# Altium schematic sheet TPS3702_Breakout.SchDoc
size A
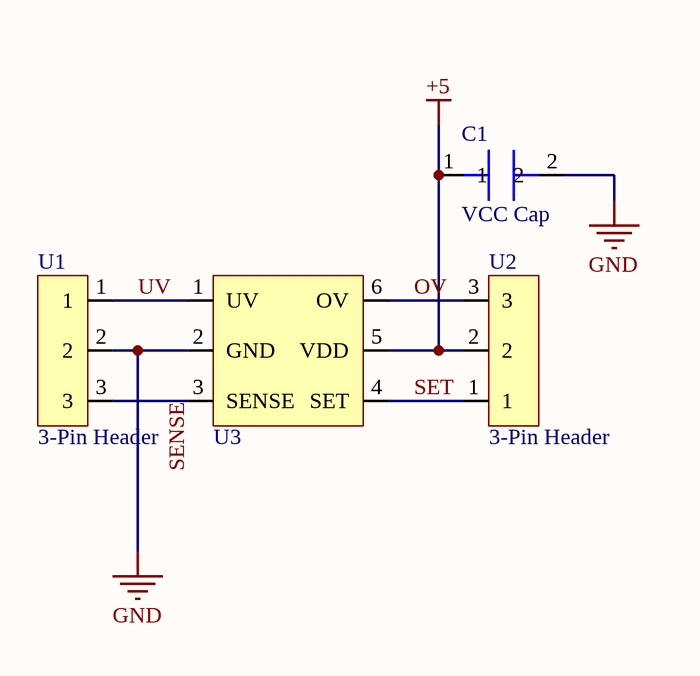
[diagram p0: TPS3702_Breakout.SchDoc]

## Parts
C1  VCC Cap  [VCC Cap]
U1  3-Pin Header  [3-Pin Header]
U2  3-Pin Header  [3-Pin Header]
U3  TPS3702  [TPS3702]  (value not drawn)

## Nets
+5: C1.1 U2.2 U3.5(VDD)
GND: C1.2 U1.2 U3.2(GND)
OV: U2.3 U3.6(OV)
SENSE: U1.3 U3.3(SENSE)
SET: U2.1 U3.4(SET)
UV: U1.1 U3.1(UV)

## Library data of the parts
C1 = VCC Cap: Noise Reducing Cap
U1 U2 = 3-Pin Header: standard 0.1 inch socket for headers
U3 = TPS3702: voltage watchdog ic